# EAGLE design Macro_Watch (EAGLE 6.6.0)
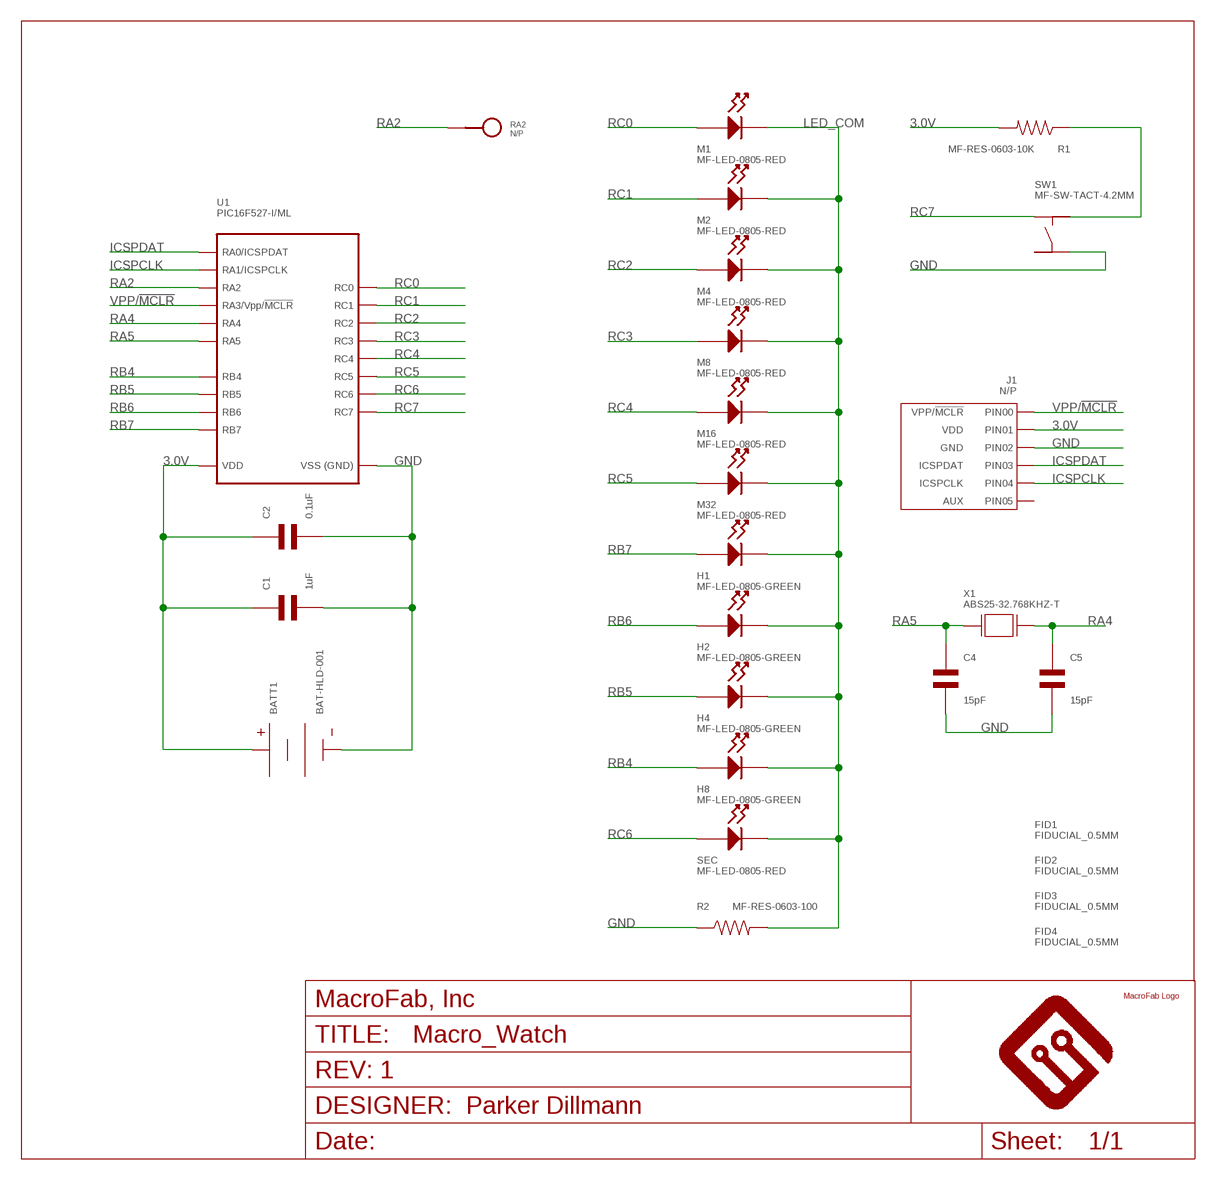
[diagram p0: schematic, sheet 1]

## Parts
BATT1  BAT-HLD-001  BATTERY_BAT-HLD-001  [BAT-HLD-001]
C1  1uF  CAPACITOR_NP_0603  [C0603]
C2  0.1uF  CAPACITOR_NP_0603  [C0603]
C4  15pF  CAPACITOR_NP_0603  [C0603]
C5  15pF  CAPACITOR_NP_0603  [C0603]
FID1  FIDUCIAL_0.5MM  [FIDUCIAL_0.5MM]
FID2  FIDUCIAL_0.5MM  [FIDUCIAL_0.5MM]
FID3  FIDUCIAL_0.5MM  [FIDUCIAL_0.5MM]
FID4  FIDUCIAL_0.5MM  [FIDUCIAL_0.5MM]
FRAME1  MF_FRAMEDEFAULT  [MF_FRAME_DEFAULT]
H1  MF-LED-0805-GREEN  LED_SINGLE_0805  [LED0805]
H2  MF-LED-0805-GREEN  LED_SINGLE_0805  [LED0805]
H4  MF-LED-0805-GREEN  LED_SINGLE_0805  [LED0805]
H8  MF-LED-0805-GREEN  LED_SINGLE_0805  [LED0805]
J1  N/P  HEADER_01X06_PTH_2.54MM  [PTH_2.54MM_01X06]
M1  MF-LED-0805-RED  LED_SINGLE_0805  [LED0805]
M2  MF-LED-0805-RED  LED_SINGLE_0805  [LED0805]
M4  MF-LED-0805-RED  LED_SINGLE_0805  [LED0805]
M8  MF-LED-0805-RED  LED_SINGLE_0805  [LED0805]
M16  MF-LED-0805-RED  LED_SINGLE_0805  [LED0805]
M32  MF-LED-0805-RED  LED_SINGLE_0805  [LED0805]
R1  MF-RES-0603-10K  RESISTOR_0603  [R0603]
R2  MF-RES-0603-100  RESISTOR_0603  [R0603]
RA2  N/P  TEST_POINT_SINGLE_ROUND_1MM  [ROUND_TP]
SEC  MF-LED-0805-RED  LED_SINGLE_0805  [LED0805]
SW1  MF-SW-TACT-4.2MM  TACT_4.2MM  [TACT4.2MM]
U1  PIC16F527-I/ML  [QFN20]
U$1  MF_LOGOLOGO_SMALL  [MF_LOGO_SMALL]
X1  ABS25-32.768KHZ-T  ABS25  [ABS25_SERIES]

## Nets
3.0V: BATT1.POS_0(POS) BATT1.POS_1(POS) C1.P$1 C2.P$1 J1.P$2(PIN1) R1.P$2 U1.P$18(VDD)
GND: BATT1.NEG_0(NEG) C1.P$2 C2.P$2 C4.P$2 C5.P$2 J1.P$3(PIN2) R2.P$1 SW1.P$4 U1.P$17(GND)
ICSPCLK: J1.P$5(PIN4) U1.P$15(RA1/ICSPCLK)
ICSPDAT: J1.P$4(PIN3) U1.P$16(RA0/ICSPDAT)
LED_COM: H1.CATHODE H2.CATHODE H4.CATHODE H8.CATHODE M1.CATHODE M2.CATHODE M4.CATHODE M8.CATHODE M16.CATHODE M32.CATHODE R2.P$2 SEC.CATHODE
N$1: R1.P$1 SW1.P$2
RA2: RA2.P$1 U1.P$14(RA2)
RA4: C5.P$1 U1.P$20(RA4) X1.4(X1)
RA5: C4.P$1 U1.P$19(RA5) X1.1(X0)
RB4: H8.ANODE U1.P$10(RB4)
RB5: H4.ANODE U1.P$9(RB5)
RB6: H2.ANODE U1.P$8(RB6)
RB7: H1.ANODE U1.P$7(RB7)
RC0: M1.ANODE U1.P$13(RC0)
RC1: M2.ANODE U1.P$12(RC1)
RC2: M4.ANODE U1.P$11(RC2)
RC3: M8.ANODE U1.P$4(RC3)
RC4: M16.ANODE U1.P$3(RC4)
RC5: M32.ANODE U1.P$2(RC5)
RC6: SEC.ANODE U1.P$5(RC6)
RC7: SW1.P$1 U1.P$6(RC7)
VPP/!MCLR: J1.P$1(PIN0) U1.P$1(RA3/VPP/!MCLR!)
Unconnected: J1.P$6(PIN5) SW1.P$3

## Library data of the parts
BATT1 = MF_Connectors:BATTERY: Library: MF_Connectors Description: Batterys and Battery Connectors.
C1 C2 C4 C5 = MF_Passives:CAPACITOR_NP: Library: MF_Passives Description: Device for Non-Polarized Capacitors. Manufacture part number (MFG#), Voltage, Temperature Coefficient, and Tolerance can be added via Attributes.; MFG#: N/A; TEMP_COF: N/A; TOLERANCE: N/A; VOLTAGE: N/A
FID1-FID4 = MF_Aesthetics:FIDUCIAL: Library: MF_Aesthetics Description: Fiducial marking for PCB alignment inside PNP and other machines.
FRAME1 = MF_Aesthetics:MF_FRAME: Library: MF_Aesthetics Description: Frame for adding Meta Data to the PCB and Schematic.; DNAME: Parker Dillmann; REVNUM: REV: 1
H1 H2 H4 H8 M1 M2 M4 M8 M16 M32 SEC = MF_LEDs:LED_SINGLE: Library: MF_LEDs Description: Device for Single LED Packages. Manufacture part number (MFG#) can be added via Attributes.
J1 = MF_Connectors:HEADER_01X06: Library: MF_Connectors Description: Header Connector with 6 Positions and 01 Rows. Use the LABEL Attribute to label the pin on the schematic and PCB. You can remove the attributes on the PCB by using the SMASH function on the part and then deleting the text.; LABEL00: VPP/!MCLR; LABEL01: VDD; LABEL02: GND; LABEL03: ICSPDAT; LABEL04: ICSPCLK; LABEL05: AUX
R1 R2 = MF_Passives:RESISTOR: Library: MF_Passives Description: Device for Resistors. Manufacture part number (MFG#), Voltage, Tolerance, and Wattage Rating can be added via Attributes.; MFG#: N/A; TOLERANCE: N/A; VOLTAGE: N/A; WATTAGE: N/A
RA2 = PP_Connectors:TEST_POINT_SINGLE
SW1 = MF_Switches:TACT: Library: MF_Switches Description: Device for Tact Switches. Manufacture part number (MFG#) can be added via Attributes.
U1 = MF_IC_Digital:PIC16F527: Manufacturer Part #: PIC16F527 Manufacturer: Microchip Technology Description: 8-bit Microcontrollers - MCU 8MHz Oscillator, 8b ADC 2x Comp, 2x Amps
U$1 = PP_Aesthetics:MF_LOGO
X1 = MF_Frequency_Control:ABS25: Library: MF_Frequency_Control Manufacture: ABRACON Description: Device forABS25 Series Cyrstal Oscillators.

## Board
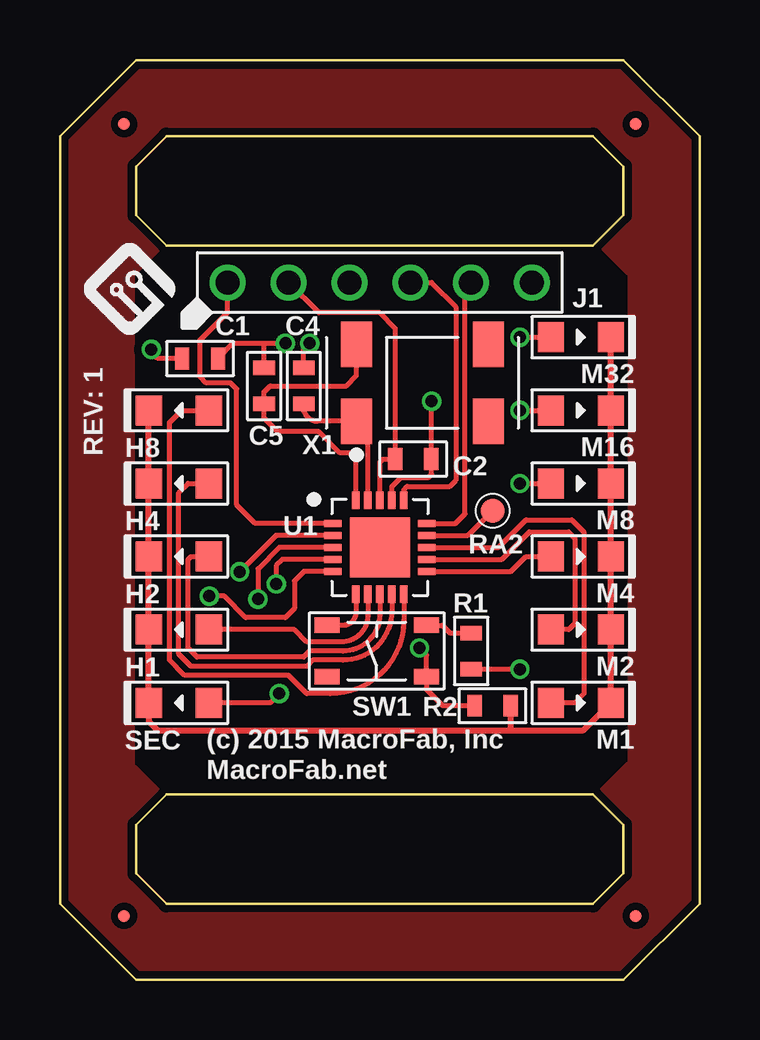
[diagram p1: board, top side]
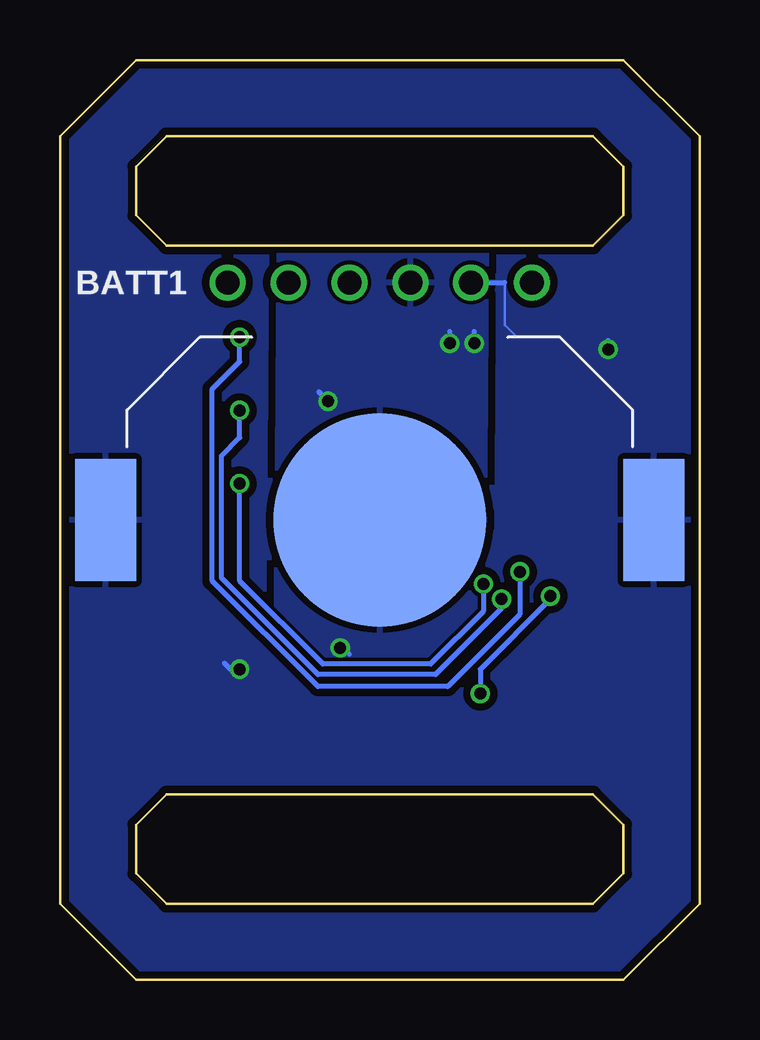
[diagram p2: board, bottom side, seen from below]

Size 26.67 x 38.35 mm. Coordinates in mm from the lower left corner, seen from the top.
Outline: 26.67,35.18 26.67,3.17 23.5,0 3.17,0 0,3.17 0,35.18 3.17,38.35 23.5,38.35 26.67,35.18
Outline: 23.5,33.91 23.5,31.88 22.23,30.61 4.45,30.61 3.17,31.88 3.17,33.91 4.45,35.18 22.23,35.18 23.5,33.91
Outline: 3.17,4.45 3.17,6.48 4.45,7.75 22.23,7.75 23.5,6.48 23.5,4.45 22.23,3.17 4.45,3.17 3.17,4.45
Copper layers (1*16): Top 0.035mm / dielectric 0.2mm / Bottom 0.035mm
Design rules "Seeed_2_Layer_DRU": minimum track width 6mil, minimum drill 12mil, track to track 6mil, track to pad 6mil, pad to pad 6mil, via to via 6mil, smd to smd 0mil, copper to edge 10mil, drill to drill 10mil, minimum pad ring 6mil, minimum via ring 6mil, stop-mask expansion 2mil, vias tented up to drill 25mil, thermal gap 10mil

### Footprints (pad centres in the part's own frame; a part is rotated, then mirrored left to right if it is on the bottom)
BAT-HLD-001 = smd 8.89 x 8.89: NEG_0 0,0 | smd 2.54 x 5.08: POS_0 11.43,0; POS_1 -11.43,0
C0603 = smd 0.6 x 0.9: P$1 -0.75,0; P$2 0.75,0
FIDUCIAL_0.5MM = smd 0.5 x 0.5: FID 0,0
LED0805 = smd 1.1 x 1.25: ANODE 1.25,0; CATHODE -1.25,0
PTH_2.54MM_01X06 = drill 1: P$1 -6.35,0; P$2 -3.81,0; P$3 -1.27,0; P$4 1.27,0; P$5 3.81,0; P$6 6.35,0
R0603 = smd 0.6 x 0.9: P$1 -0.75,0; P$2 0.75,0
ROUND_TP = smd 1 x 1: P$1 0,0
TACT4.2MM = smd 1.05 x 0.65: P$1 -2.075,1.075; P$2 2.075,1.075; P$3 -2.075,-1.075; P$4 2.075,-1.075
QFN20 = smd 0.73 x 0.3: P$1 -1.96,1; P$2 -1.96,0.5; P$3 -1.96,0; P$4 -1.96,-0.5; P$5 -1.96,-1; P$11 1.96,-1; P$12 1.96,-0.5; P$13 1.96,0; P$14 1.96,0.5; P$15 1.96,1 | smd 0.3 x 0.73: P$6 -1,-1.96; P$7 -0.5,-1.96; P$8 0,-1.96; P$9 0.5,-1.96; P$10 1,-1.96; P$16 1,1.96; P$17 0.5,1.96; P$18 0,1.96; P$19 -0.5,1.96; P$20 -1,1.96 | smd 2.5 x 2.5: PAD 0,0
ABS25_SERIES = smd 1.3 x 1.9: 1 -2.75,-1.6; 2 2.75,-1.6; 3 2.75,1.6; 4 -2.75,1.6

### Placement (x,y rotation side)
BATT1  13.34,19.18 0 bottom
C1  5.84,25.91 0 top
C2  14.73,21.72 0 top
C4  10.16,24.77 90 top
C5  8.51,24.77 90 top
FID1  2.67,2.67 0 top
FID2  2.67,35.69 0 top
FID3  24,35.69 0 top
FID4  24,2.67 0 top
FRAME1  6.1,10.92 0 top
H1  4.95,14.61 0 top
H2  4.95,17.65 0 top
H4  4.95,20.7 0 top
H8  4.95,23.75 0 top
J1  13.34,29.08 0 top
M1  21.72,11.56 180 top
M2  21.72,14.61 180 top
M4  21.72,17.65 180 top
M8  21.72,20.7 180 top
M16  21.72,23.75 180 top
M32  21.72,26.8 180 top
R1  17.14,13.72 270 top
R2  18.03,11.43 0 top
RA2  18.03,19.56 0 top
SEC  4.95,11.56 0 top
SW1  13.21,13.72 0 top
U1  13.34,18.03 0 top
U$1  1.02,26.92 0 top
X1  15.11,24.89 0 top

### Tracks (layer width: path | path; a pad name or v marks a point on that pad's centre or on a via)
3.0V  (via drill 0.5)
  Top 0.203: R1.P$2 19.16,12.97 v19.18,12.95 | J1.P$2 10.79,27.81 13.34,27.81 13.98,27.17 C2.P$1 13.46,21.72 13.34,21.59 U1.P$18 | C1.P$1 4.19,25.91 arc-90 v3.81,26.29
  Bottom 0.102: 8.13,29.08 8.13,27.3 7.62,26.8
  Bottom 0.203: 19.56,12.95 19.81,13.21 | J1.P$2 8.13,29.08 | v3.81,26.29 3.81,26.67
  pour Bottom (isolate 0.305, rank 2): -0.13,38.48 -0.13,-0.13 8.26,-0.13 8.26,38.48
  pour Bottom (isolate 0.305, rank 2): 8.26,38.48 8,-0.13 26.54,-0.13 26.8,38.48
GND  (via drill 0.5)
  Top 0.203: R2.P$1 15.96,11.43 15.28,12.11 SW1.P$4 15.28,13.55 v14.99,13.84 | C5.P$2 8.51,26.54 | 8.76,26.54 v9.4,26.54 8.51,26.54 | U1.P$17 13.84,20.57 14.22,20.95 15.37,20.95 15.49,21.08 15.49,21.7 | 15.49,21.7 v15.49,24.13 | 15.49,21.7 C2.P$2 | C1.P$2 7.23,26.54 8.51,26.54 | C4.P$2 10.16,26.29 v10.41,26.54
  Bottom 0.203: v10.41,26.54 10.41,27.05 | v9.4,26.54 9.4,27.05 | v14.99,13.84 14.86,13.84 14.61,13.59 | v15.49,24.13 15.88,24.51
  pour Bottom: 8.89,30.35 9.02,12.83 17.65,12.83 17.53,30.35
ICSPCLK
  Top 0.203: J1.P$5 16.89,28.83 16.89,19.43 16.49,19.03 U1.P$15
ICSPDAT
  Top 0.203: J1.P$4 15.49,29.08 16.51,28.07 16.51,20.83 16.26,20.57 14.48,20.57 14.34,20.43 U1.P$16
LED_COM
  Top 0.254: M32.CATHODE M16.CATHODE M8.CATHODE M4.CATHODE M2.CATHODE M1.CATHODE 21.82,10.41 18.78,10.41 | H8.CATHODE H4.CATHODE H2.CATHODE H1.CATHODE SEC.CATHODE 3.7,10.78 4.06,10.41 18.78,10.41 | R2.P$2 18.78,10.41
N$1
  Top 0.203: SW1.P$2 15.94,14.79 16.26,14.48 R1.P$1
N$2
  pour Top (isolate 0.305): 23.52,38.35 3.15,38.35 0,35.2 0,3.06 3.06,0 23.5,0 26.67,3.17 26.67,35.2
N$3
  cutout Top: 4.45,30.61 3.17,29.34 3.17,9.02 4.45,7.75 3.17,6.48 3.17,4.45 4.45,3.17 22.23,3.17 23.5,4.45 23.5,6.48 22.23,7.75 23.62,9.14 23.62,29.34 22.35,30.61 23.5,31.75 23.5,33.91 22.23,35.18 4.45,35.18 3.17,33.91 3.17,31.88
RA2
  Top 0.203: U1.P$14 17.01,18.53 RA2.P$1
RA4
  Top 0.203: U1.P$20 12.34,21.7 12.06,21.97 11.68,21.97 10.79,22.86 9.07,22.86 8.51,23.42 C5.P$1 8.51,24.51 8.76,24.77 11.94,24.77 12.36,25.19 X1.4
RA5
  Top 0.203: U1.P$19 12.84,23.07 X1.1 10.74,23.29 arc-90 10.16,23.87 C4.P$1
RB4
  Top 0.203: H8.ANODE 5.08,23.75 4.57,23.24 4.57,13.34 5.21,12.7 9.53,12.7 10.29,11.94 11.28,11.94 arc90 14.34,14.99 U1.P$10
RB5
  Top 0.203: H4.ANODE 5.33,20.7 4.95,20.32 4.95,13.59 5.46,13.08 10.29,13.08 10.54,13.34 11.79,13.34 arc90 13.84,15.38 U1.P$9
RB6
  Top 0.203: H2.ANODE 5.46,17.65 5.33,17.53 5.33,13.84 5.71,13.46 10.16,13.46 10.41,13.72 11.8,13.72 arc90 13.34,15.25 U1.P$8
RB7
  Top 0.203: U1.P$7 12.84,15.2 arc-90 11.74,14.1 10.29,14.1 9.78,14.61 H1.ANODE
RC0
  Top 0.203: M1.ANODE 21.46,11.56 21.84,11.94 21.84,18.67 21.34,19.18 19.43,19.18 18.29,18.03 U1.P$13
RC1
  Top 0.203: M2.ANODE 21.21,14.61 21.46,14.86 21.46,18.41 21.2,18.68 19.57,18.68 18.42,17.53 U1.P$12
RC2
  Top 0.203: U1.P$11 18.81,17.03 19.43,17.65 M4.ANODE
RC3  (via drill 0.5)
  Top 0.203: v9.02,16.51 9.02,17.27 9.28,17.53 U1.P$4 | v19.18,20.7 M8.ANODE
  Bottom 0.203: v9.02,16.51 9.02,15.37 11.22,13.17 15.71,13.17 19.18,16.64 v19.18,20.7
RC4  (via drill 0.5)
  Top 0.203: v8.26,15.88 8.26,17.14 9.14,18.03 U1.P$3 | v19.18,23.75 M16.ANODE
  Bottom 0.203: v8.26,15.88 8.26,15.49 11.01,12.74 15.91,12.74 19.94,16.76 19.94,21.84 19.18,22.61 v19.18,23.75
RC5  (via drill 0.5)
  Top 0.203: v19.18,26.8 M32.ANODE | U1.P$2 9.01,18.53 v7.49,17.02
  Bottom 0.203: v19.18,26.8 19.18,25.78 20.32,24.64 20.32,16.64 15.92,12.23 10.5,12.23 7.49,15.24 v7.49,17.02
RC6  (via drill 0.5)
  Top 0.203: v6.22,16 6.86,16 7.75,15.11 9.4,15.11 9.78,15.49 9.78,16.64 10.18,17.03 U1.P$5 | v9.14,11.94 8.76,11.56 SEC.ANODE
  Bottom 0.203: v6.22,16 6.22,15.88 9.14,12.95 v9.14,11.94
RC7
  Top 0.203: U1.P$6 12.34,15.3 arc-90 11.82,14.79 SW1.P$1
VPP/!MCLR
  Top 0.203: U1.P$1 8.14,19.03 7.37,19.81 7.37,24.64 7.11,24.89 6.1,24.89 5.84,25.15 5.84,26.67 6.99,27.81 J1.P$1